# Altium schematic sheet 05.Audio.SchDoc
size A4; CheckedBy: YPC; DocumentNumber: 5; Revision: V1.00; SheetNumber: 05; SheetTotal: 18; SheetName: Audio; SheetDescribe: SheetDescribe; Designer: JOW; DesignDate: 2025-04-25; CheckedData: 2025-04-25
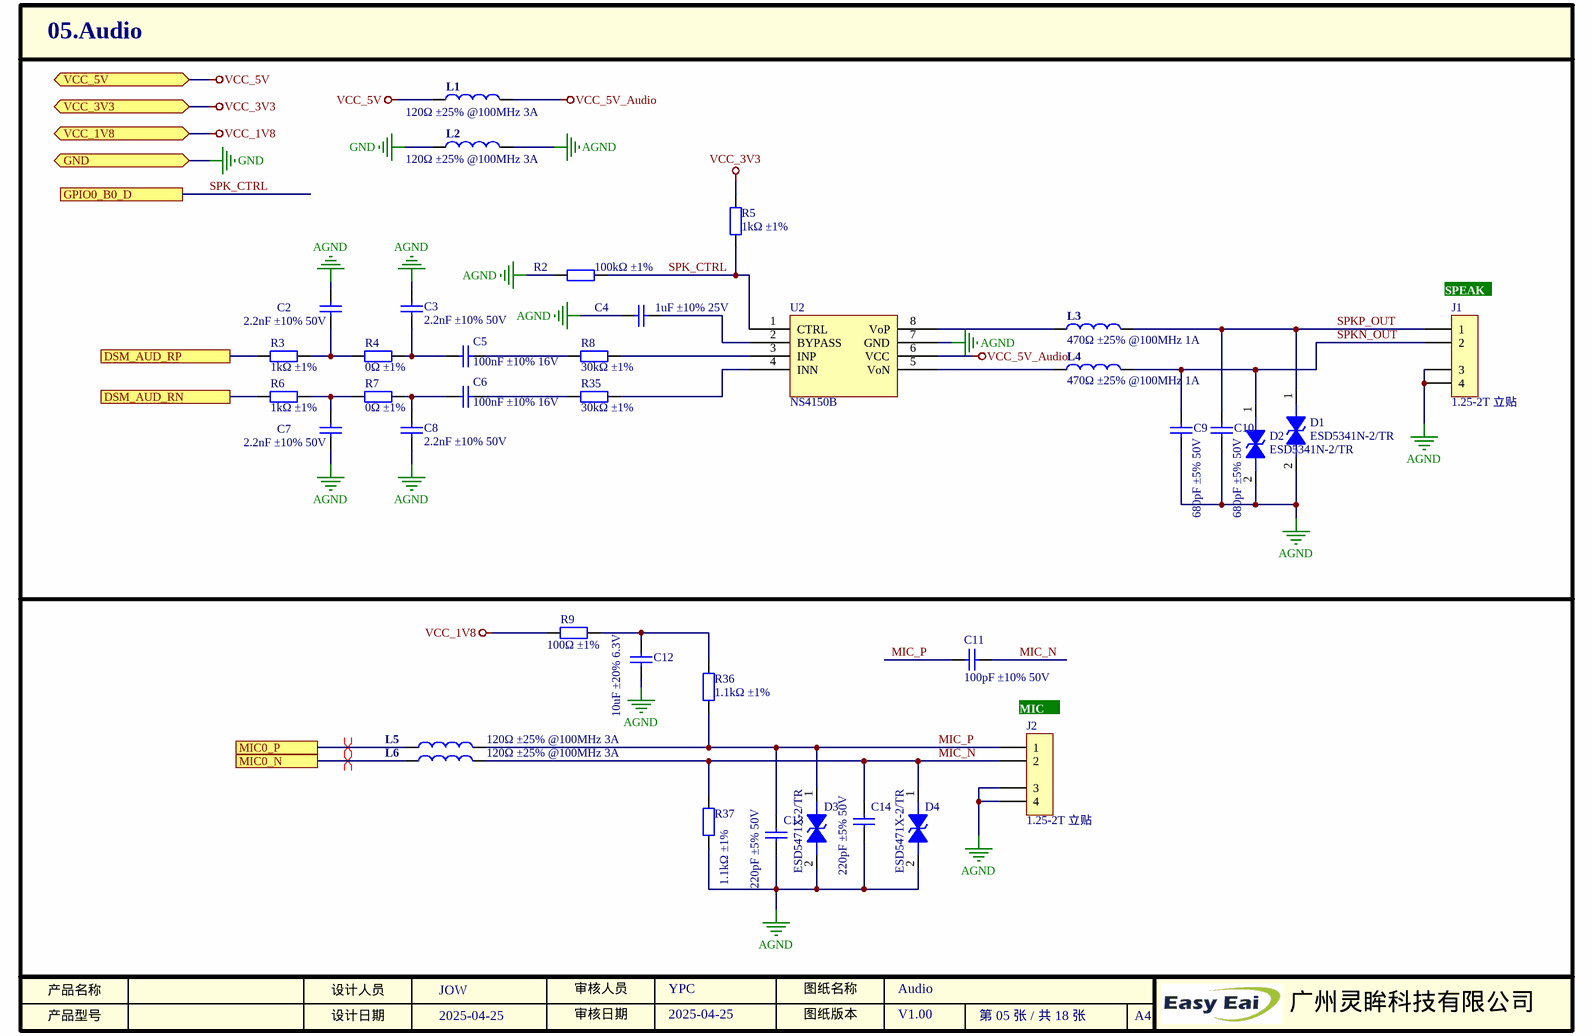
[diagram p0: 05.Audio.SchDoc]

## Parts
C2  描述: 2.2nF ±10% 50V  [0402_C]  (hidden comment: 0402B222K500NT)
C3  描述: 2.2nF ±10% 50V  [0402_C]  (hidden comment: 0402B222K500NT)  (no BOM)
C4  描述: 1uF ±10% 25V  [0402_C]  (hidden comment: CL05A105KA5NQNC)
C5  描述: 100nF ±10% 16V  [0402_C]  (hidden comment: CL05B104KO5NNNC)
C6  描述: 100nF ±10% 16V  [0402_C]  (hidden comment: CL05B104KO5NNNC)
C7  描述: 2.2nF ±10% 50V  [0402_C]  (hidden comment: 0402B222K500NT)
C8  描述: 2.2nF ±10% 50V  [0402_C]  (hidden comment: 0402B222K500NT)  (no BOM)
C9  描述: 680pF ±5% 50V  [0402_C]  (hidden comment: CL05C681JB5NNNC)
C10  描述: 680pF ±5% 50V  [0402_C]  (hidden comment: CL05C681JB5NNNC)
C11  描述: 100pF ±10% 50V  [0402_C]  (hidden comment: CC0402KRX7R9BB101)
C12  描述: 10uF ±20% 6.3V  [0402_C]  (hidden comment: CL05A106MQ5NUNC)
C13  描述: 220pF ±5% 50V  [0402_C]  (hidden comment: GCM1555G1H221JA16D)
C14  描述: 220pF ±5% 50V  [0402_C]  (hidden comment: GCM1555G1H221JA16D)
D1  ESD5341N-2/TR  [DFN1006-2L]
D2  ESD5341N-2/TR  [DFN1006-2L]
D3  ESD5471X-2/TR  [FBP-02C]
D4  ESD5471X-2/TR  [FBP-02C]
J1  AFC12-S02CCA-00  [1.25-2T_SMD_L]  (value not drawn)
J2  AFC12-S02CCA-00  [1.25-2T_SMD_L]  (value not drawn)
L1  BLM18KG121TN1D  [0603_R]  (value not drawn)
L2  BLM18KG121TN1D  [0603_R]  (value not drawn)
L3  PZ1608U471-1R0TF  [0603_R]  (value not drawn)
L4  PZ1608U471-1R0TF  [0603_R]  (value not drawn)
L5  BLM18KG121TN1D  [0603_R]  (value not drawn)
L6  BLM18KG121TN1D  [0603_R]  (value not drawn)
R2  描述: 100kΩ ±1%  [0402_R]  (hidden comment: 0402WGF1003TCE)
R3  描述: 1kΩ ±1%  [0402_R]  (hidden comment: 0402WGF1001TCE)
R4  描述: 0Ω ±1%  [0402_R]  (hidden comment: 0402WGF0000TCE)
R5  描述: 1kΩ ±1%  [0402_R]  (hidden comment: 0402WGF1001TCE)
R6  描述: 1kΩ ±1%  [0402_R]  (hidden comment: 0402WGF1001TCE)
R7  描述: 0Ω ±1%  [0402_R]  (hidden comment: 0402WGF0000TCE)
R8  描述: 30kΩ ±1%  [0402_R]  (hidden comment: NQ02WGF3002TCE)
R9  描述: 100Ω ±1%  [0402_R]  (hidden comment: 0402WGF1000TCE)
R35  描述: 30kΩ ±1%  [0402_R]  (hidden comment: NQ02WGF3002TCE)
R36  描述: 1.1kΩ ±1%  [0402_R]  (hidden comment: AC0402FR-071K1L)
R37  描述: 1.1kΩ ±1%  [0402_R]  (hidden comment: AC0402FR-071K1L)
U2  NS4150B  [MSOP-8]

## Ports
DSM_AUD_RN, DSM_AUD_RP, GND, GPIO0_B0_D, MIC0_N, MIC0_P, VCC_1V8, VCC_3V3, VCC_5V

## Nets
AGND: C2.2 C3.2 C4.1 C7.1 C8.1 C9.1 C10.1 C12.1 C13.1 C14.1 D1.2 D2.2 D3.2 D4.2 J1.3 J1.4 J2.3 J2.4 L2.2 R2.1 R37.1 U2.7(GND)
GND: L2.1 ; port GND
VCC_1V8: R9.1 ; port VCC_1V8
VCC_3V3: R5.2 ; port VCC_3V3
VCC_5V: L1.1 ; port VCC_5V
VCC_5V_Audio: L1.2 U2.6(VCC)
DSM_AUD_RN: R6.1 ; port DSM_AUD_RN
DSM_AUD_RP: R3.1 ; port DSM_AUD_RP
MIC0_N: L6.1 ; port MIC0_N
MIC0_P: L5.1 ; port MIC0_P
MIC_N: C11.2 C14.2 D4.1 J2.2 L6.2 R37.2
MIC_P: C11.1 C13.2 D3.1 J2.1 L5.2 R36.1
SPK_CTRL: R2.2 R5.1 U2.1(CTRL) ; port GPIO0_B0_D
SPKN_OUT: C9.2 D2.1 J1.2 L4.2
SPKP_OUT: C10.2 D1.1 J1.1 L3.2
NetC2_1: C2.1 R3.2 R4.1
NetC3_1: C3.1 C5.1 R4.2
NetC4_2: C4.2 U2.2(BYPASS)
NetC5_2: C5.2 R8.1
NetC6_1: C6.1 C8.2 R7.2
NetC6_2: C6.2 R35.1
NetC7_2: C7.2 R6.2 R7.1
NetC12_2: C12.2 R9.2 R36.2
NetL3_1: L3.1 U2.8(VoP)
NetL4_1: L4.1 U2.5(VoN)
NetR8_2: R8.2 U2.3(INP)
NetR35_2: R35.2 U2.4(INN)

## Layout directives
differential pair: MIC0_N, MIC0_P

## Notes on the sheet
- (near J1) SPEAK
- (near J2) MIC
- 产品名称
- 产品型号
- 设计人员
- 设计日期
- 审核人员
- 审核日期
- 图纸版本
- 图纸名称
- A4
- 广州灵眸科技有限公司

## Library data of the parts
C2 C3 C7 C8 = 0402 2.2nF ±10% 50V: SPZL000399; 名称: 贴片电容; 厂商: FH(风华); 封装: 0402; 工作温度: -55~125℃; 贴片和直插: SMD; 型号: 0402B222K500NT; SuppliersPartNumber: C1531; 商品编号: SPZL000399
C4 = 0402 1uF ±10% 25V: SPZL000337; 名称: 贴片电容; 厂商: SAMSUNG(三星); 封装: 0402; 工作温度: -55~85℃; 贴片和直插: SMD; 型号: CL05A105KA5NQNC; SuppliersPartNumber: C52923; 商品编号: SPZL000337
C5 C6 = 0402 100nF ±10% 16V: SPZL000259; 名称: 贴片电容; 厂商: SAMSUNG(三星); 封装: 0402; 工作温度: -55~125℃; 贴片和直插: SMD; 型号: CL05B104KO5NNNC; SuppliersPartNumber: C1525; 商品编号: SPZL000259
C9 C10 = 0402 680pF ±5% 50V: SPZL000317; 名称: 贴片电容; 厂商: SAMSUNG(三星); 封装: 0402; 工作温度: -55~125℃; 贴片和直插: SMD; 型号: CL05C681JB5NNNC; SuppliersPartNumber: C307451; 商品编号: SPZL000317
C11 = 0402 100pF ±10% 50V: SPZL000312; 名称: 贴片电容; 厂商: YAGEO(国巨); 封装: 0402; 工作温度: -55~125℃; 贴片和直插: SMD; 型号: CC0402KRX7R9BB101; SuppliersPartNumber: C281751; 商品编号: SPZL000312
C12 = 0402 10uF ±20% 6.3V: SPZL000269; 名称: 贴片电容; 厂商: SAMSUNG(三星); 封装: 0402; 工作温度: -55~85℃; 贴片和直插: SMD; 型号: CL05A106MQ5NUNC; SuppliersPartNumber: C15525; 商品编号: SPZL000269
C13 C14 = 0402 220pF ±5% 50V: SPZL000318; 名称: 贴片电容; 厂商: muRata(村田); 封装: 0402; 工作温度: -55~150℃; 贴片和直插: SMD; 型号: GCM1555G1H221JA16D; SuppliersPartNumber: C1517776; 商品编号: SPZL000318
D1 D2 = TVS ESD5341N-2/TR: SPZL000253; 名称: TVS; 贴片和直插: SMD; 厂商: WILLSEMI(韦尔); 描述: Vdrm=5V Cj=1pF; 工作温度: -40~85℃; 封装: DFN1006-2L; 商品编号: SPZL000253; SuppliersPartNumber: C239773; 型号: ESD5341N-2/TR
D3 D4 = TVS ESD5471X-2/TR: SPZL000254; 名称: TVS; 贴片和直插: SMD; 厂商: WillSemi(韦尔半导体); 描述: Vdrm=5V Cj=9pF; 工作温度: -40~85℃; SuppliersPartNumber: C239631; 封装: FBP-02C; 商品编号: SPZL000254; 型号: ESD5471X-2/TR
J1 J2 = 1.25-2T 立贴: SPZL000112; 名称: 线对板/线对线连接器; 封装: SMD; 厂商: JS(钜硕电子); 工作温度: -20~85℃; 贴片和直插: SMD; SuppliersPartNumber: C466544; 型号: AFC12-S02CCA-00; 商品编号: SPZL000112; 描述: 1.25-2T 立贴
L1 L2 L5 L6 = 120Ω ±25% @100MHz 3A: SPZL000842; 名称: 磁珠; 封装: 0603; 厂商: muRata(村田); 贴片和直插: SMD; 工作温度: -40~85℃; SuppliersPartNumber: C85831; 型号: BLM18KG121TN1D; 商品编号: SPZL000842; 描述: 120Ω ±25% @100MHz 3A
L3 L4 = 470Ω ±25% @100MHz 1A: SPZL000054; 名称: 磁珠; 封装: 0603; 厂商: Sunlord(顺络); 贴片和直插: SMD; 工作温度: -55~125℃; SuppliersPartNumber: C42103; 型号: PZ1608U471-1R0TF; 商品编号: SPZL000054; 描述: 470Ω ±25% @100MHz 1A
R2 = 0402 100kΩ ±1%: SPZL000282; 封装: 0402; 厂商: UNI-ROYAL(厚声); 贴片和直插: SMD; 名称: 电阻; 工作温度: -55~155℃; SuppliersPartNumber: C25741; 型号: 0402WGF1003TCE; 商品编号: SPZL000282
R3 R5 R6 = 0402 1kΩ ±1%: SPZL000275; 封装: 0402; 厂商: UNI-ROYAL(厚声); 贴片和直插: SMD; 名称: 电阻; 工作温度: -55~125℃; SuppliersPartNumber: C11702; 型号: 0402WGF1001TCE; 商品编号: SPZL000275
R4 R7 = 0402 0Ω ±1%: SPZL000276; 封装: 0402; 厂商: UNI-ROYAL(厚声); 贴片和直插: SMD; 名称: 电阻; 工作温度: -55~125℃; SuppliersPartNumber: C17168; 型号: 0402WGF0000TCE; 商品编号: SPZL000276
R8 R35 = 0402 30kΩ ±1%: SPZL000323; 封装: 0402; 厂商: UNI-ROYAL(厚声); 贴片和直插: SMD; 名称: 电阻; 工作温度: -55~155℃; SuppliersPartNumber: C965267; 型号: NQ02WGF3002TCE; 商品编号: SPZL000323
R9 = 0402 100Ω ±1%: SPZL000281; 封装: 0402; 厂商: UNI-ROYAL(厚声); 贴片和直插: SMD; 名称: 电阻; 工作温度: -55~155℃; SuppliersPartNumber: C25076; 型号: 0402WGF1000TCE; 商品编号: SPZL000281
R36 R37 = 0402 1.1kΩ ±1%: SPZL000324; 封装: 0402; 厂商: YAGEO(国巨); 贴片和直插: SMD; 名称: 电阻; 工作温度: -55~125℃; SuppliersPartNumber: C226844; 型号: AC0402FR-071K1L; 商品编号: SPZL000324
U2 = NS4150B: SPZL000086; 名称: IC; 厂商: Nsiway(纳芯威); 贴片和直插: SMD; 规格: 3W单声道D类音频功放; 工作温度: -40~85℃; 封装: MSOP-8; SuppliersPartNumber: C189961; 商品编号: SPZL000086; 型号: NS4150B